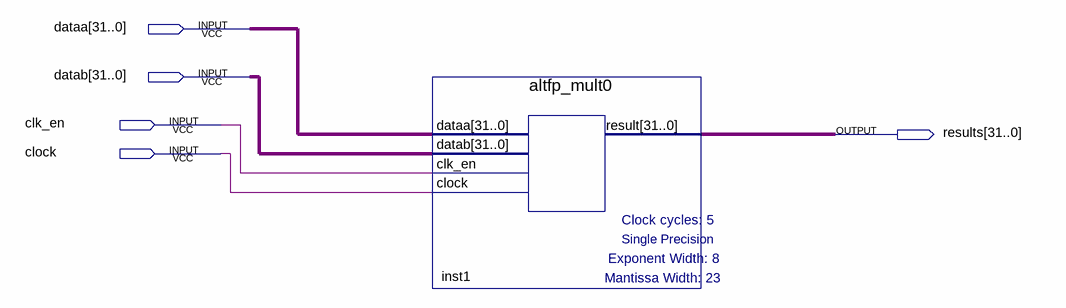
[diagram p0: schematic sheet]
// Quartus schematic FloatMult.bdf as structural Verilog: 1 symbols, 5 pins
module FloatMult (
  input  [31:0] dataa,
  input  [31:0] datab,
  input  clk_en,
  input  clock,
  output [31:0] results
);

  altfp_mult0 inst1 (.dataa(dataa), .datab(datab), .clk_en(clk_en), .clock(clock), .result(results));
endmodule
